# Altium schematic sheet 00-INTRO.SchDoc
size A4
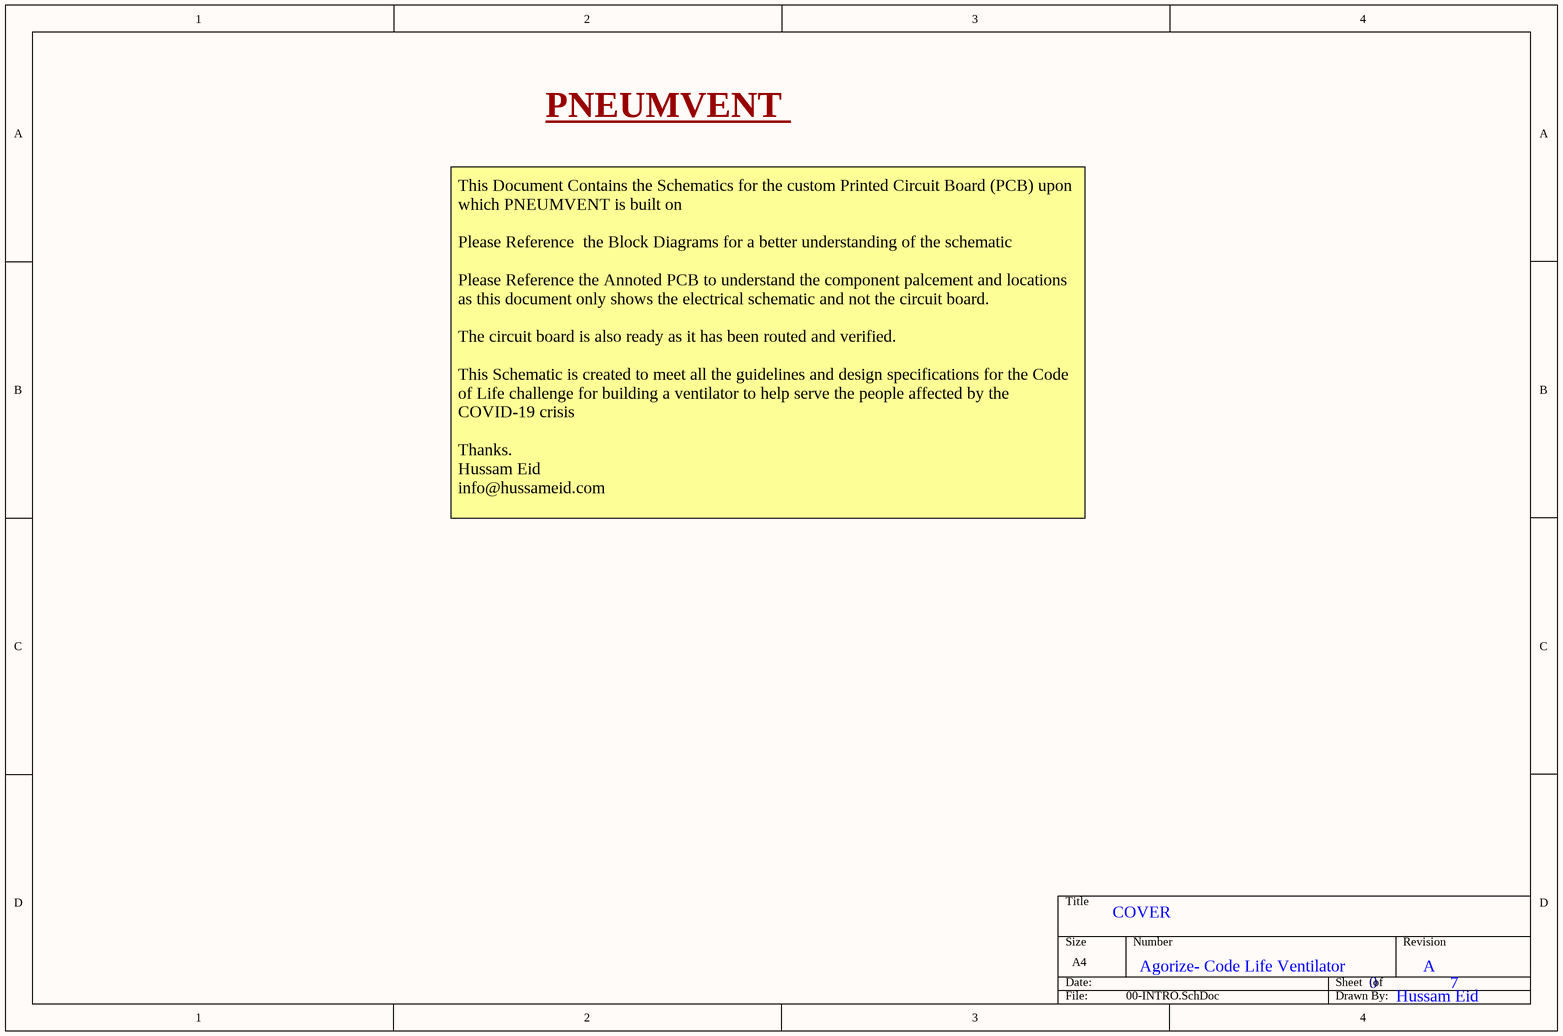
[diagram p0: 00-INTRO.SchDoc]

## Notes on the sheet
- PNEUMVENT
- This Document Contains the Schematics for the custom Printed Circuit Board (PCB) upon which PNEUMVENT is built on
  Please Reference  the Block Diagrams for a better understanding of the schematic
  Please Reference the Annoted PCB to understand the component palcement and locations as this document only shows the electrical schematic and not the circuit board.
  The circuit board is also ready as it has been routed and verified.
  This Schematic is created to meet all the guidelines and design specifications for the Code of Life challenge for building a ventilator to help serve the people affected by the COVID-19 crisis
  Thanks.
  Hussam Eid
  info@hussameid.com
- COVER
- Agorize- Code Life Ventilator
- 0
- A
- 7
- Hussam Eid